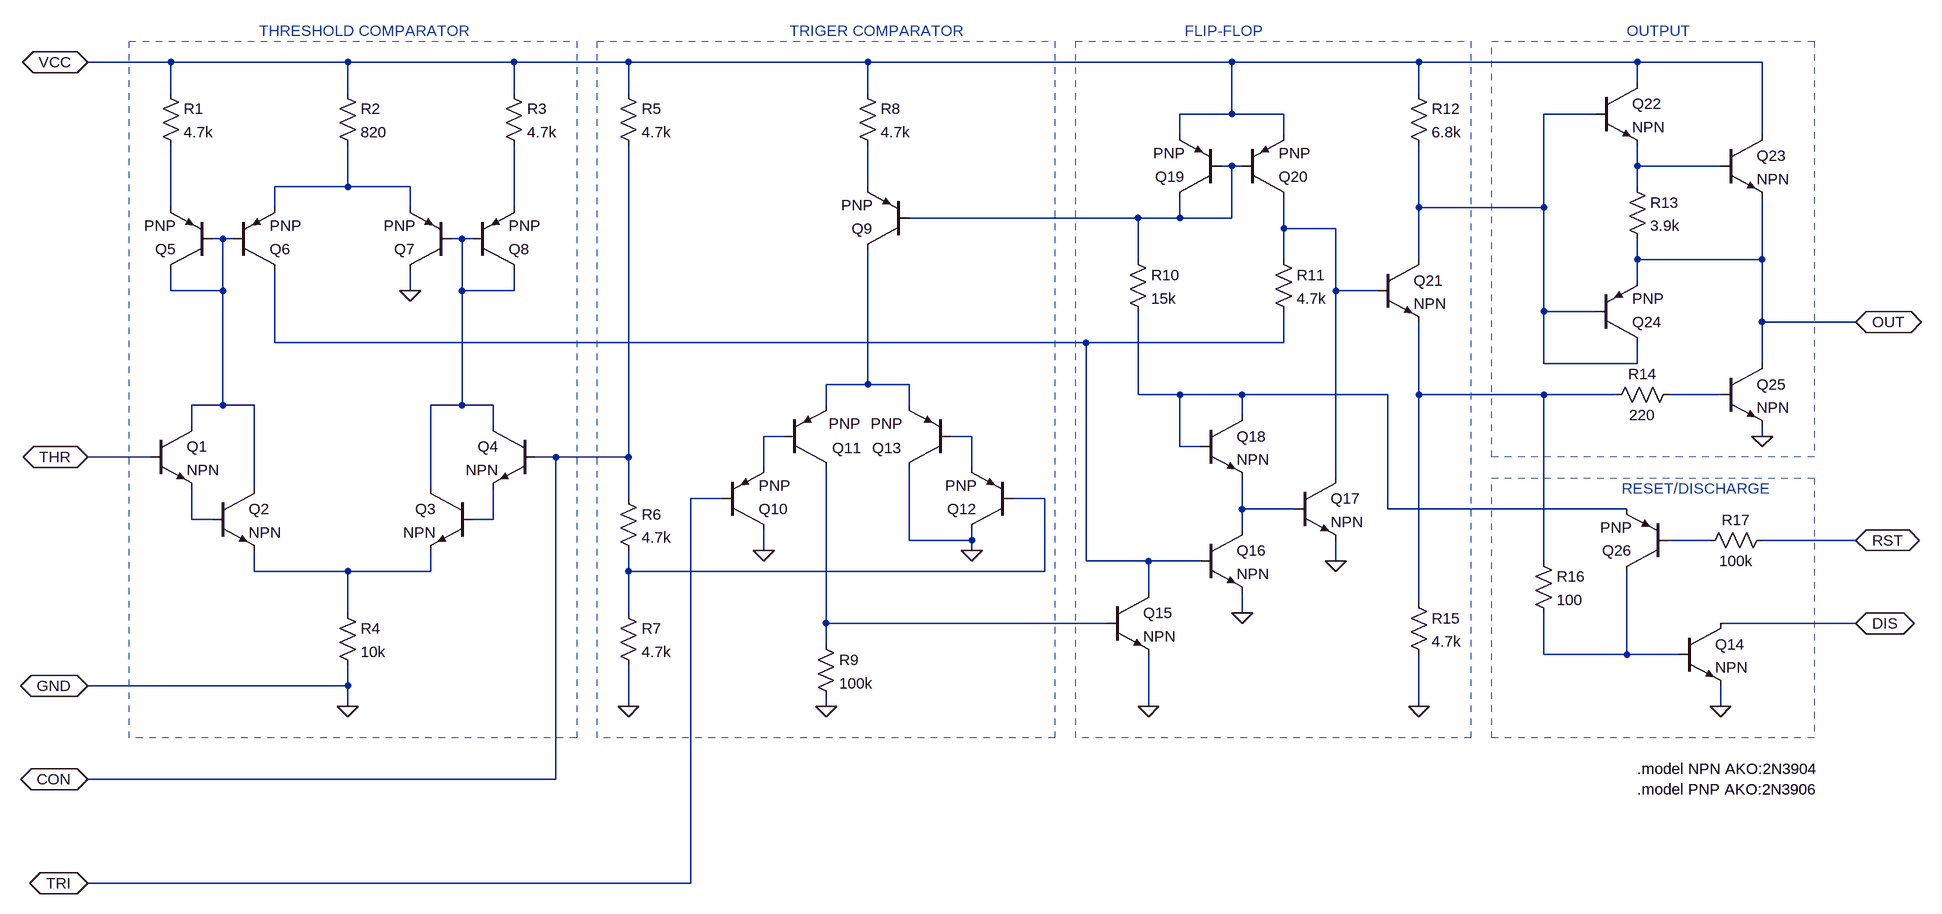
[diagram p0: schematic 555T.asc]
555T.asc, the LTspice schematic file:
Version 4
SHEET 1 2556 680
WIRE -608 -1424 -736 -1424
WIRE -336 -1424 -608 -1424
WIRE -80 -1424 -336 -1424
WIRE 96 -1424 -80 -1424
WIRE 464 -1424 96 -1424
WIRE 1024 -1424 464 -1424
WIRE 1312 -1424 1024 -1424
WIRE 1648 -1424 1312 -1424
WIRE 1840 -1424 1648 -1424
WIRE 1648 -1392 1648 -1424
WIRE -608 -1376 -608 -1424
WIRE -336 -1376 -336 -1424
WIRE -80 -1376 -80 -1424
WIRE 96 -1376 96 -1424
WIRE 464 -1376 464 -1424
WIRE 1312 -1376 1312 -1424
WIRE 1024 -1344 1024 -1424
WIRE 1024 -1344 944 -1344
WIRE 1104 -1344 1024 -1344
WIRE 1584 -1344 1504 -1344
WIRE 944 -1312 944 -1344
WIRE 1104 -1312 1104 -1344
WIRE 1840 -1312 1840 -1424
WIRE 1024 -1264 1008 -1264
WIRE 1040 -1264 1024 -1264
WIRE 1648 -1264 1648 -1296
WIRE 1776 -1264 1648 -1264
WIRE -336 -1232 -336 -1296
WIRE -336 -1232 -448 -1232
WIRE -240 -1232 -336 -1232
WIRE 464 -1232 464 -1296
WIRE 1648 -1232 1648 -1264
WIRE -608 -1200 -608 -1296
WIRE -448 -1200 -448 -1232
WIRE -240 -1200 -240 -1232
WIRE -80 -1200 -80 -1296
WIRE 1312 -1200 1312 -1296
WIRE 1504 -1200 1504 -1344
WIRE 1504 -1200 1312 -1200
WIRE 880 -1184 528 -1184
WIRE 944 -1184 944 -1216
WIRE 944 -1184 880 -1184
WIRE 1024 -1184 1024 -1264
WIRE 1024 -1184 944 -1184
WIRE 1104 -1168 1104 -1216
WIRE 1184 -1168 1104 -1168
WIRE -528 -1152 -544 -1152
WIRE -512 -1152 -528 -1152
WIRE -160 -1152 -176 -1152
WIRE -144 -1152 -160 -1152
WIRE 880 -1120 880 -1184
WIRE 1104 -1120 1104 -1168
WIRE 1312 -1120 1312 -1200
WIRE 1648 -1120 1648 -1152
WIRE 1840 -1120 1840 -1216
WIRE 1840 -1120 1648 -1120
WIRE 1648 -1088 1648 -1120
WIRE -608 -1072 -608 -1104
WIRE -528 -1072 -528 -1152
WIRE -528 -1072 -608 -1072
WIRE -240 -1072 -240 -1104
WIRE -160 -1072 -160 -1152
WIRE -80 -1072 -80 -1104
WIRE -80 -1072 -160 -1072
WIRE 1184 -1072 1184 -1168
WIRE 1248 -1072 1184 -1072
WIRE 1504 -1040 1504 -1200
WIRE 1584 -1040 1504 -1040
WIRE 1840 -1024 1840 -1120
WIRE 1984 -1024 1840 -1024
WIRE -448 -992 -448 -1104
WIRE 800 -992 -448 -992
WIRE 1104 -992 1104 -1040
WIRE 1104 -992 800 -992
WIRE 1504 -960 1504 -1040
WIRE 1648 -960 1648 -992
WIRE 1648 -960 1504 -960
WIRE 1840 -960 1840 -1024
WIRE 464 -928 464 -1136
WIRE 464 -928 400 -928
WIRE 528 -928 464 -928
WIRE 880 -912 880 -1040
WIRE 944 -912 880 -912
WIRE 1040 -912 944 -912
WIRE 1264 -912 1040 -912
WIRE 1312 -912 1312 -1024
WIRE 1504 -912 1312 -912
WIRE 1616 -912 1504 -912
WIRE 1776 -912 1696 -912
WIRE -528 -896 -528 -1072
WIRE -528 -896 -576 -896
WIRE -480 -896 -528 -896
WIRE -160 -896 -160 -1072
WIRE -160 -896 -208 -896
WIRE -112 -896 -160 -896
WIRE 400 -896 400 -928
WIRE 528 -896 528 -928
WIRE 1040 -880 1040 -912
WIRE -576 -864 -576 -896
WIRE -112 -864 -112 -896
WIRE 336 -848 304 -848
WIRE 624 -848 592 -848
WIRE 1840 -848 1840 -864
WIRE 944 -832 944 -912
WIRE 976 -832 944 -832
WIRE -640 -816 -736 -816
WIRE -16 -816 -48 -816
WIRE 96 -816 96 -1296
WIRE 96 -816 -16 -816
WIRE 304 -800 304 -848
WIRE 624 -800 624 -848
WIRE 1184 -784 1184 -1072
WIRE -480 -768 -480 -896
WIRE -208 -768 -208 -896
WIRE 96 -752 96 -816
WIRE 240 -752 192 -752
WIRE 736 -752 688 -752
WIRE 1040 -736 1040 -784
WIRE 1120 -736 1040 -736
WIRE 1264 -736 1264 -912
WIRE 1632 -736 1264 -736
WIRE -576 -720 -576 -768
WIRE -544 -720 -576 -720
WIRE -112 -720 -112 -768
WIRE -112 -720 -144 -720
WIRE 1040 -704 1040 -736
WIRE 528 -688 528 -800
WIRE 624 -688 624 -704
WIRE 624 -688 528 -688
WIRE 1760 -688 1696 -688
WIRE 1984 -688 1840 -688
WIRE 304 -672 304 -704
WIRE 624 -672 624 -688
WIRE 800 -656 800 -992
WIRE 896 -656 800 -656
WIRE 976 -656 896 -656
WIRE 1184 -656 1184 -688
WIRE 1504 -656 1504 -912
WIRE -480 -640 -480 -672
WIRE -336 -640 -480 -640
WIRE -208 -640 -208 -672
WIRE -208 -640 -336 -640
WIRE 96 -640 96 -672
WIRE 736 -640 736 -752
WIRE 736 -640 96 -640
WIRE 896 -608 896 -656
WIRE 1312 -592 1312 -912
WIRE -336 -576 -336 -640
WIRE 96 -576 96 -640
WIRE 1040 -576 1040 -608
WIRE 400 -560 400 -800
WIRE 832 -560 400 -560
WIRE 1984 -560 1776 -560
WIRE 400 -528 400 -560
WIRE 1504 -512 1504 -576
WIRE 1632 -512 1632 -640
WIRE 1632 -512 1504 -512
WIRE 1712 -512 1632 -512
WIRE -336 -464 -336 -496
WIRE -336 -464 -736 -464
WIRE -336 -432 -336 -464
WIRE 96 -432 96 -496
WIRE 400 -432 400 -448
WIRE 896 -432 896 -512
WIRE 1312 -432 1312 -512
WIRE 1776 -432 1776 -464
WIRE -16 -320 -16 -816
WIRE -16 -320 -736 -320
WIRE 192 -160 192 -752
WIRE 192 -160 -736 -160
FLAG -240 -1072 0
FLAG -336 -432 0
FLAG -736 -1424 VCC
IOPIN -736 -1424 BiDir
FLAG -736 -816 THR
IOPIN -736 -816 BiDir
FLAG -736 -464 GND
IOPIN -736 -464 BiDir
FLAG -736 -320 CON
IOPIN -736 -320 BiDir
FLAG 96 -432 0
FLAG 304 -672 0
FLAG 624 -672 0
FLAG 400 -432 0
FLAG 1040 -576 0
FLAG 896 -432 0
FLAG 1184 -656 0
FLAG 1312 -432 0
FLAG 1840 -848 0
FLAG 1984 -1024 OUT
IOPIN 1984 -1024 BiDir
FLAG 1984 -688 RST
IOPIN 1984 -688 BiDir
FLAG 1776 -432 0
FLAG 1984 -560 DIS
IOPIN 1984 -560 BiDir
FLAG -736 -160 TRI
IOPIN -736 -160 BiDir
SYMBOL npn -640 -864 R0
SYMATTR InstName Q1
SYMBOL npn -544 -768 R0
SYMATTR InstName Q2
SYMBOL npn -144 -768 M0
SYMATTR InstName Q3
SYMBOL npn -48 -864 M0
SYMATTR InstName Q4
SYMBOL pnp -544 -1104 R180
SYMATTR InstName Q5
SYMBOL pnp -512 -1104 M180
SYMATTR InstName Q6
SYMBOL pnp -176 -1104 R180
SYMATTR InstName Q7
SYMBOL pnp -144 -1104 M180
SYMATTR InstName Q8
SYMBOL res -624 -1392 R0
SYMATTR InstName R1
SYMATTR Value 4.7k
SYMBOL res -352 -1392 R0
SYMATTR InstName R2
SYMATTR Value 820
SYMBOL res -96 -1392 R0
SYMATTR InstName R3
SYMATTR Value 4.7k
SYMBOL res -352 -592 R0
SYMATTR InstName R4
SYMATTR Value 10k
SYMBOL res 80 -1392 R0
SYMATTR InstName R5
SYMATTR Value 4.7k
SYMBOL res 80 -768 R0
SYMATTR InstName R6
SYMATTR Value 4.7k
SYMBOL res 80 -592 R0
SYMATTR InstName R7
SYMATTR Value 4.7k
SYMBOL res 448 -1392 R0
SYMATTR InstName R8
SYMATTR Value 4.7k
SYMBOL pnp 528 -1136 R180
SYMATTR InstName Q9
SYMBOL pnp 240 -704 M180
SYMATTR InstName Q10
SYMBOL pnp 336 -800 M180
WINDOW 0 73 30 Left 2
WINDOW 3 68 68 Left 2
SYMATTR InstName Q11
SYMBOL pnp 688 -704 R180
SYMATTR InstName Q12
SYMBOL pnp 592 -800 R180
WINDOW 0 75 30 Left 2
WINDOW 3 75 68 Left 2
SYMATTR InstName Q13
SYMBOL res 384 -544 R0
SYMATTR InstName R9
SYMATTR Value 100k
SYMBOL npn 1712 -560 R0
SYMATTR InstName Q14
SYMBOL npn 832 -608 R0
SYMATTR InstName Q15
SYMBOL npn 976 -704 R0
SYMATTR InstName Q16
SYMBOL npn 1120 -784 R0
SYMATTR InstName Q17
SYMBOL npn 976 -880 R0
SYMATTR InstName Q18
SYMBOL res 864 -1136 R0
SYMATTR InstName R10
SYMATTR Value 15k
SYMBOL pnp 1008 -1216 R180
SYMATTR InstName Q19
SYMBOL pnp 1040 -1216 M180
SYMATTR InstName Q20
SYMBOL res 1088 -1136 R0
SYMATTR InstName R11
SYMATTR Value 4.7k
SYMBOL res 1296 -1392 R0
SYMATTR InstName R12
SYMATTR Value 6.8k
SYMBOL npn 1248 -1120 R0
SYMATTR InstName Q21
SYMBOL res 1632 -1248 R0
SYMATTR InstName R13
SYMATTR Value 3.9k
SYMBOL res 1600 -896 R270
WINDOW 0 32 56 VTop 2
WINDOW 3 0 56 VBottom 2
SYMATTR InstName R14
SYMATTR Value 220
SYMBOL res 1296 -608 R0
SYMATTR InstName R15
SYMATTR Value 4.7k
SYMBOL npn 1584 -1392 R0
SYMATTR InstName Q22
SYMBOL npn 1776 -1312 R0
SYMATTR InstName Q23
SYMBOL pnp 1584 -992 M180
SYMATTR InstName Q24
SYMBOL npn 1776 -960 R0
SYMATTR InstName Q25
SYMBOL pnp 1696 -640 R180
SYMATTR InstName Q26
SYMBOL res 1488 -672 R0
SYMATTR InstName R16
SYMATTR Value 100
SYMBOL res 1744 -672 R270
WINDOW 0 32 56 VTop 2
WINDOW 3 0 56 VBottom 2
SYMATTR InstName R17
SYMATTR Value 100k
TEXT 1648 -336 Left 2 !.model NPN AKO:2N3904\n.model PNP AKO:2N3906
TEXT -472 -1472 Left 2 ;THRESHOLD COMPARATOR
TEXT 344 -1472 Left 2 ;TRIGER COMPARATOR
TEXT 952 -1472 Left 2 ;FLIP-FLOP
TEXT 1632 -1472 Left 2 ;OUTPUT
TEXT 1624 -768 Left 2 ;RESET/DISCHARGE
RECTANGLE Normal 16 -384 -672 -1456 2
RECTANGLE Normal 752 -384 48 -1456 2
RECTANGLE Normal 1392 -384 784 -1456 2
RECTANGLE Normal 1920 -816 1424 -1456 2
RECTANGLE Normal 1920 -384 1424 -784 2

The netlist it stands for:
* 555T.asc
Q1 N009 THR N020 0 NPN
Q2 N009 N020 N023 0 NPN
Q3 N010 N021 N023 0 NPN
Q4 N010 CON N021 0 NPN
Q5 N009 N009 N006 0 PNP
Q6 N011 N009 N004 0 PNP
Q7 0 N010 N004 0 PNP
Q8 N010 N010 N007 0 PNP
R1 VCC N006 4.7k
R2 VCC N004 820
R3 VCC N007 4.7k
R4 N023 0 10k
R5 VCC CON 4.7k
R6 CON N018 4.7k
R7 N018 0 4.7k
R8 VCC N005 4.7k
Q9 N012 N002 N005 0 PNP
Q10 0 TRI N016 0 PNP
Q11 N024 N016 N012 0 PNP
Q12 0 N018 N017 0 PNP
Q13 0 N017 N012 0 PNP
R9 N024 0 100k
Q14 DIS N025 0 0 NPN
Q15 N011 N024 0 0 NPN
Q16 N019 N011 0 0 NPN
Q17 N008 N019 0 0 NPN
Q18 N013 N013 N019 0 NPN
R10 N002 N013 15k
Q19 N002 N002 VCC 0 PNP
Q20 N008 N002 VCC 0 PNP
R11 N008 N011 4.7k
R12 VCC N001 6.8k
Q21 N001 N008 N014 0 NPN
R13 N003 OUT 3.9k
R14 N014 N015 220
R15 N014 0 4.7k
Q22 VCC N001 N003 0 NPN
Q23 VCC N003 OUT 0 NPN
Q24 N001 N001 OUT 0 PNP
Q25 OUT N015 0 0 NPN
Q26 N025 N022 N013 0 PNP
R16 N014 N025 100
R17 N022 RST 100k
.model NPN NPN
.model PNP PNP
.lib standard.bjt
.model NPN AKO:2N3904
.model PNP AKO:2N3906
* THRESHOLD COMPARATOR
* TRIGER COMPARATOR
* FLIP-FLOP
* OUTPUT
* RESET/DISCHARGE
.backanno
.end